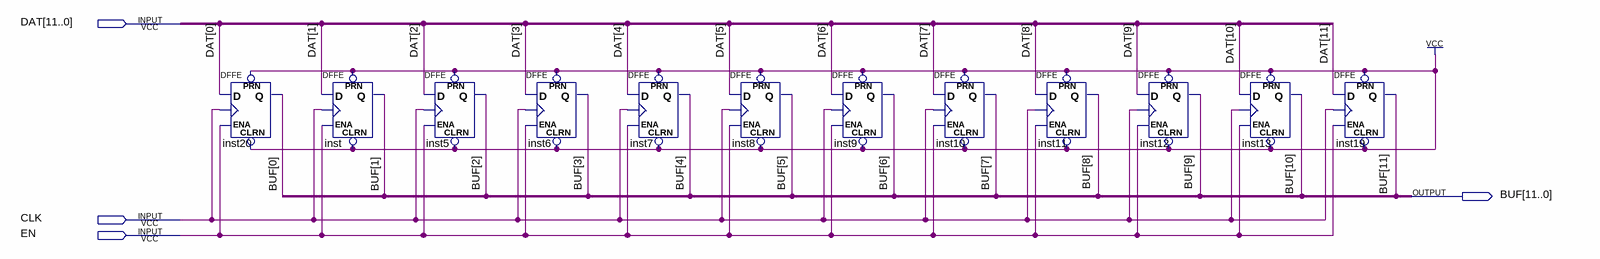
[diagram p0: schematic sheet]
// Quartus schematic Registro.bdf as structural Verilog: 12 symbols, 4 pins
module Registro (
  input  [11:0] DAT,
  input  CLK,
  input  EN,
  output [11:0] BUF
);

  DFFE inst20 (.PRN(1'b1), .CLRN(1'b1), .D(DAT[0]), .CLK(CLK), .ENA(EN), .Q(BUF[0]));
  DFFE inst (.PRN(1'b1), .CLRN(1'b1), .D(DAT[1]), .CLK(CLK), .ENA(EN), .Q(BUF[1]));
  DFFE inst5 (.PRN(1'b1), .CLRN(1'b1), .D(DAT[2]), .CLK(CLK), .ENA(EN), .Q(BUF[2]));
  DFFE inst6 (.PRN(1'b1), .CLRN(1'b1), .D(DAT[3]), .CLK(CLK), .ENA(EN), .Q(BUF[3]));
  DFFE inst7 (.PRN(1'b1), .CLRN(1'b1), .D(DAT[4]), .CLK(CLK), .ENA(EN), .Q(BUF[4]));
  DFFE inst8 (.PRN(1'b1), .CLRN(1'b1), .D(DAT[5]), .CLK(CLK), .ENA(EN), .Q(BUF[5]));
  DFFE inst9 (.PRN(1'b1), .CLRN(1'b1), .D(DAT[6]), .CLK(CLK), .ENA(EN), .Q(BUF[6]));
  DFFE inst10 (.PRN(1'b1), .CLRN(1'b1), .D(DAT[7]), .CLK(CLK), .ENA(EN), .Q(BUF[7]));
  DFFE inst11 (.PRN(1'b1), .CLRN(1'b1), .D(DAT[8]), .CLK(CLK), .ENA(EN), .Q(BUF[8]));
  DFFE inst12 (.PRN(1'b1), .CLRN(1'b1), .D(DAT[9]), .CLK(CLK), .ENA(EN), .Q(BUF[9]));
  DFFE inst13 (.PRN(1'b1), .CLRN(1'b1), .D(DAT[10]), .CLK(CLK), .ENA(EN), .Q(BUF[10]));
  DFFE inst19 (.PRN(1'b1), .CLRN(1'b1), .D(DAT[11]), .CLK(CLK), .ENA(EN), .Q(BUF[11]));
endmodule
